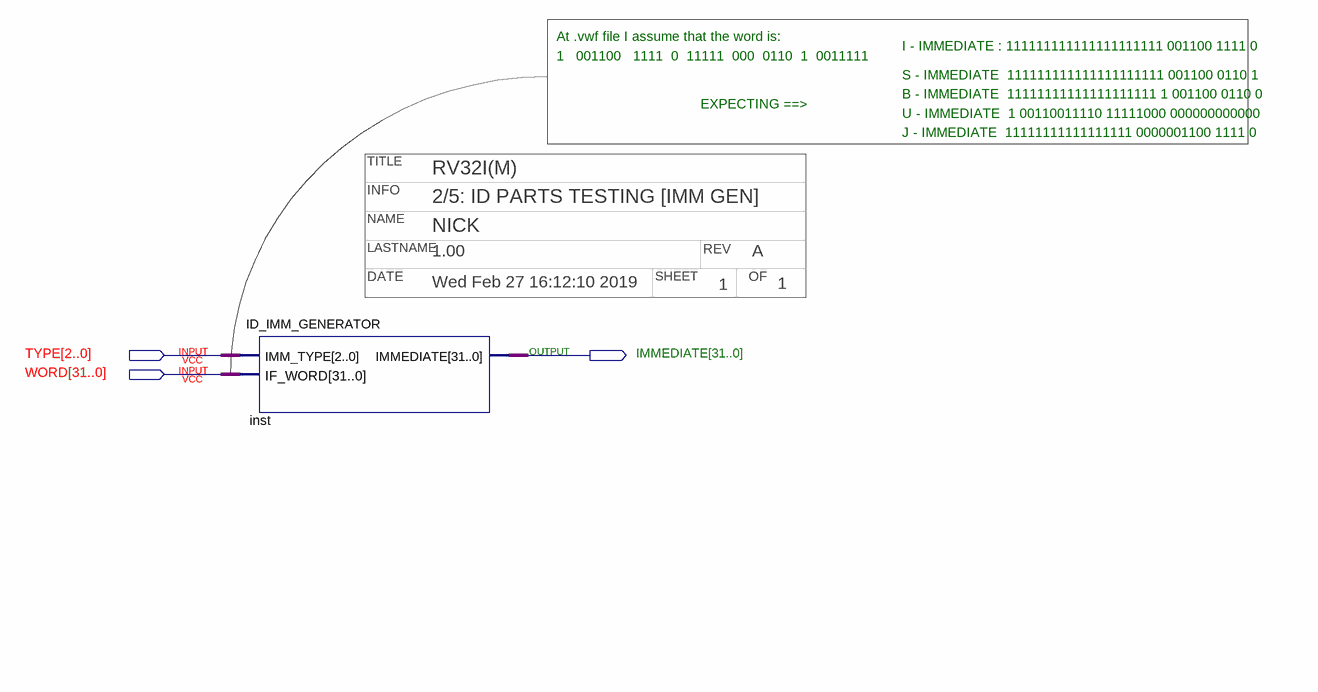
[diagram p0: schematic sheet]
// Quartus schematic ID_IMM_GENERATORTEST.bdf as structural Verilog: 1 symbols, 3 pins
// Title block: TITLE: RV32I(M); INFO: 2/5: ID PARTS TESTING [IMM GEN]; NAME: NICK; LASTNAME: 1.00; REV: A; DATE: Wed Feb 27 16:12:10 2019; SHEET: 1; OF: 1
module ID_IMM_GENERATORTEST (
  input  [2:0] TYPE,
  input  [31:0] WORD,
  output [31:0] IMMEDIATE
);

  ID_IMM_GENERATOR inst (.IMM_TYPE(TYPE), .IF_WORD(WORD), .IMMEDIATE(IMMEDIATE));

  // Notes on the sheet:
  //   At .vwf file I assume that the word is:
  //   I - IMMEDIATE : 111111111111111111111 001100 1111 0
  //   1   001100   1111  0  11111  000  0110  1  0011111
  //   S - IMMEDIATE  111111111111111111111 001100 0110 1
  //   B - IMMEDIATE  11111111111111111111 1 001100 0110 0
  //   EXPECTING ==>
  //   U - IMMEDIATE  1 00110011110 11111000 000000000000
  //   J - IMMEDIATE  11111111111111111 0000001100 1111 0
endmodule
